# EAGLE schematic Hauptplatine (EAGLE 8.6.0)
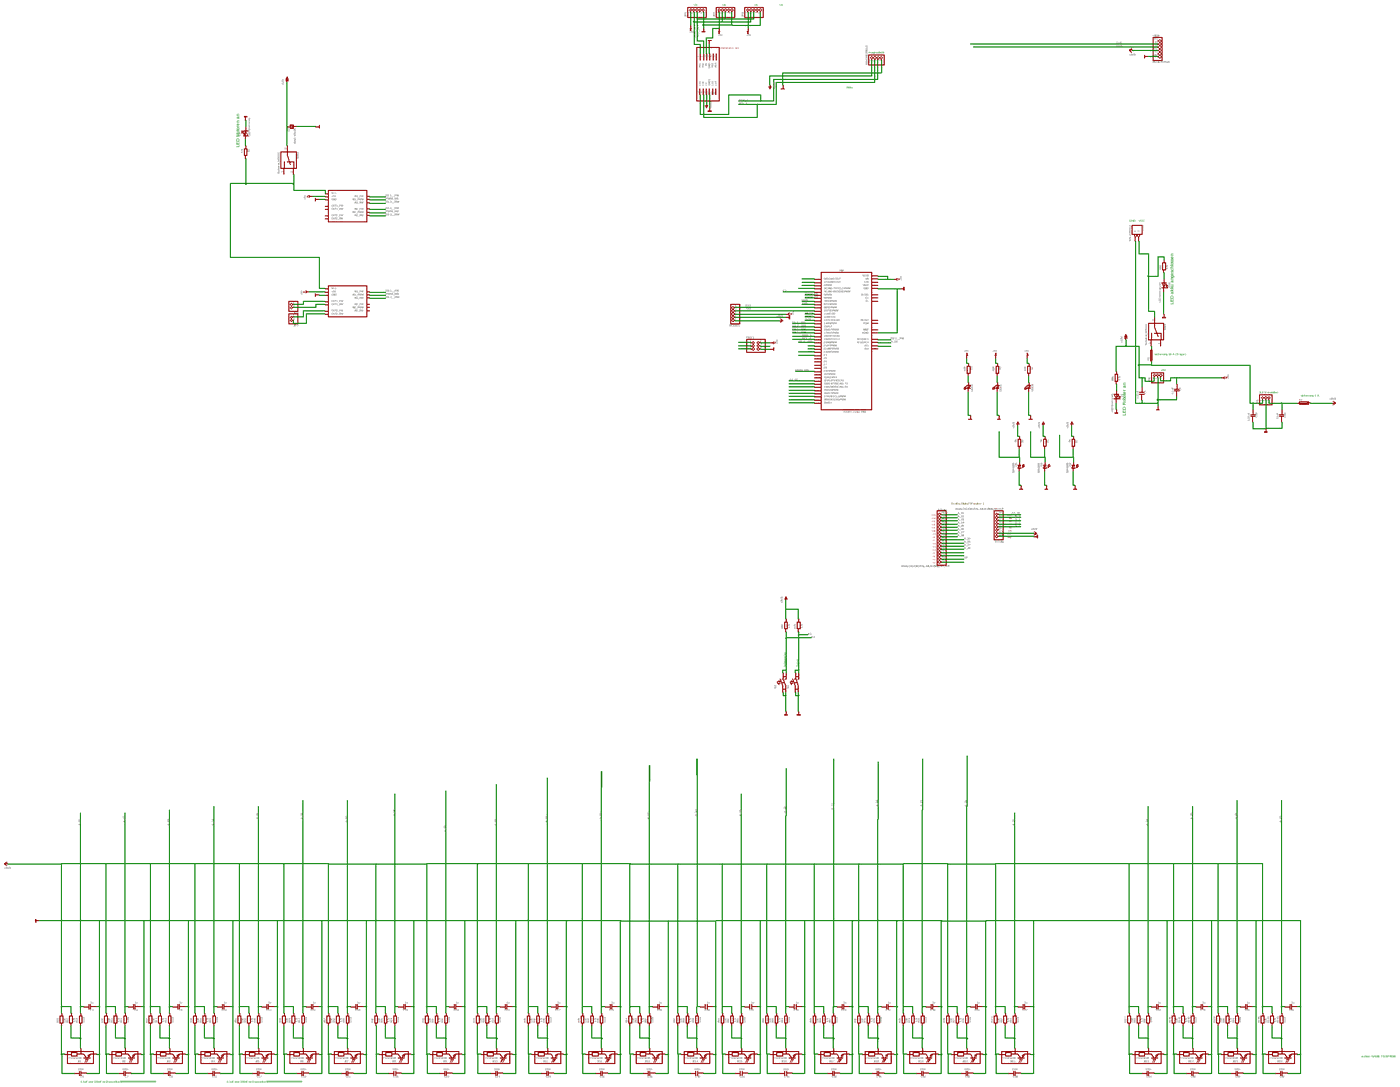
[diagram p0: schematic, sheet 1, overview]
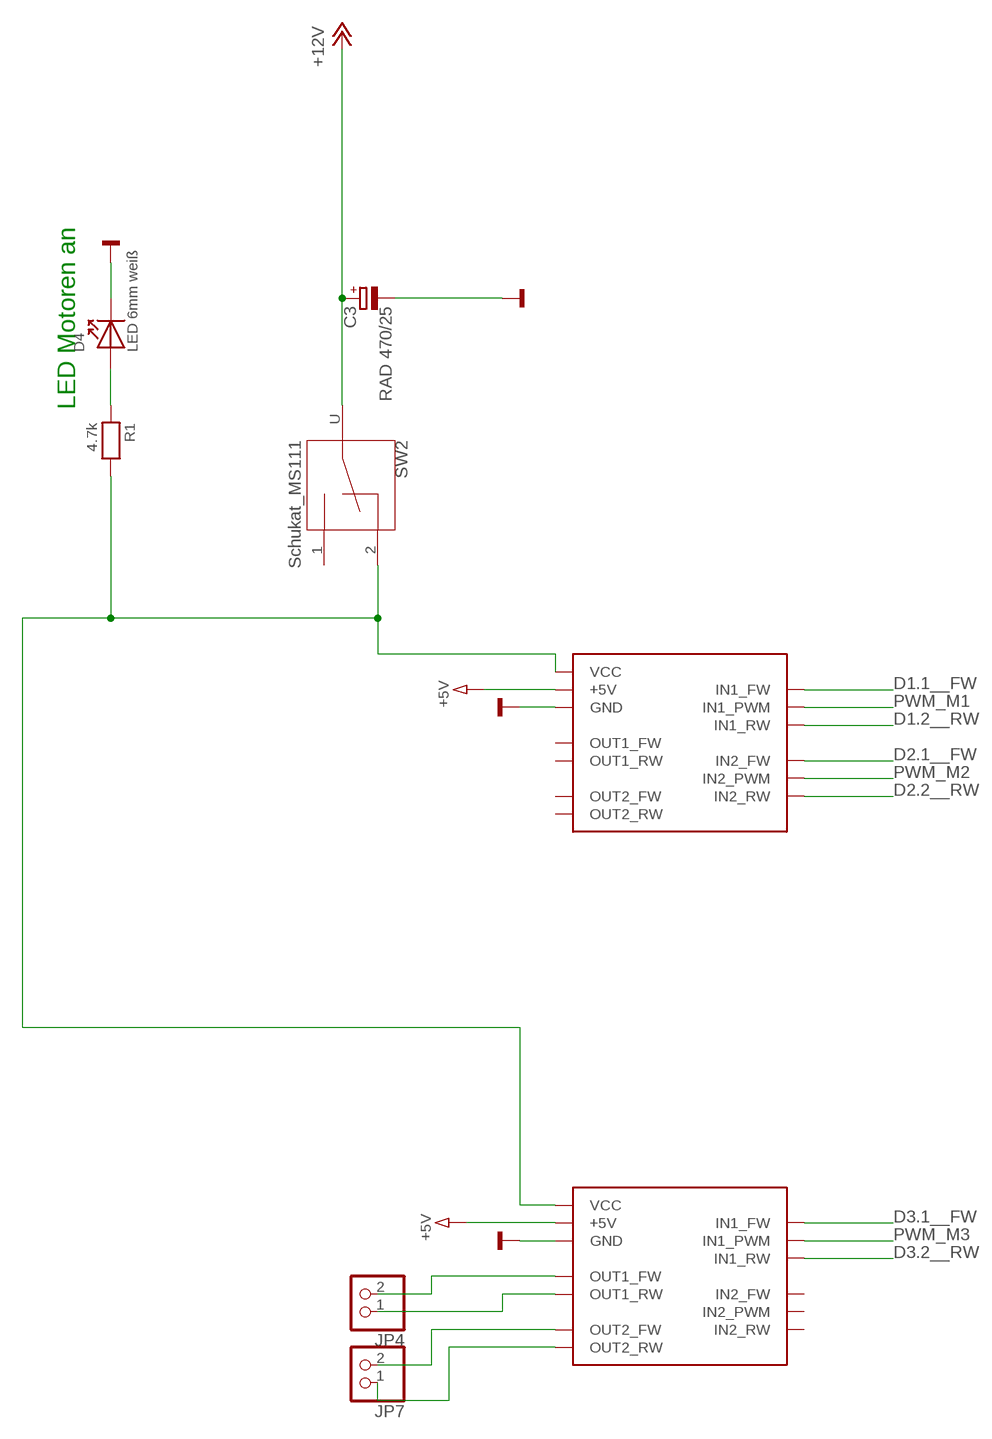
[diagram p1: schematic, sheet 1, part 1 of 6]
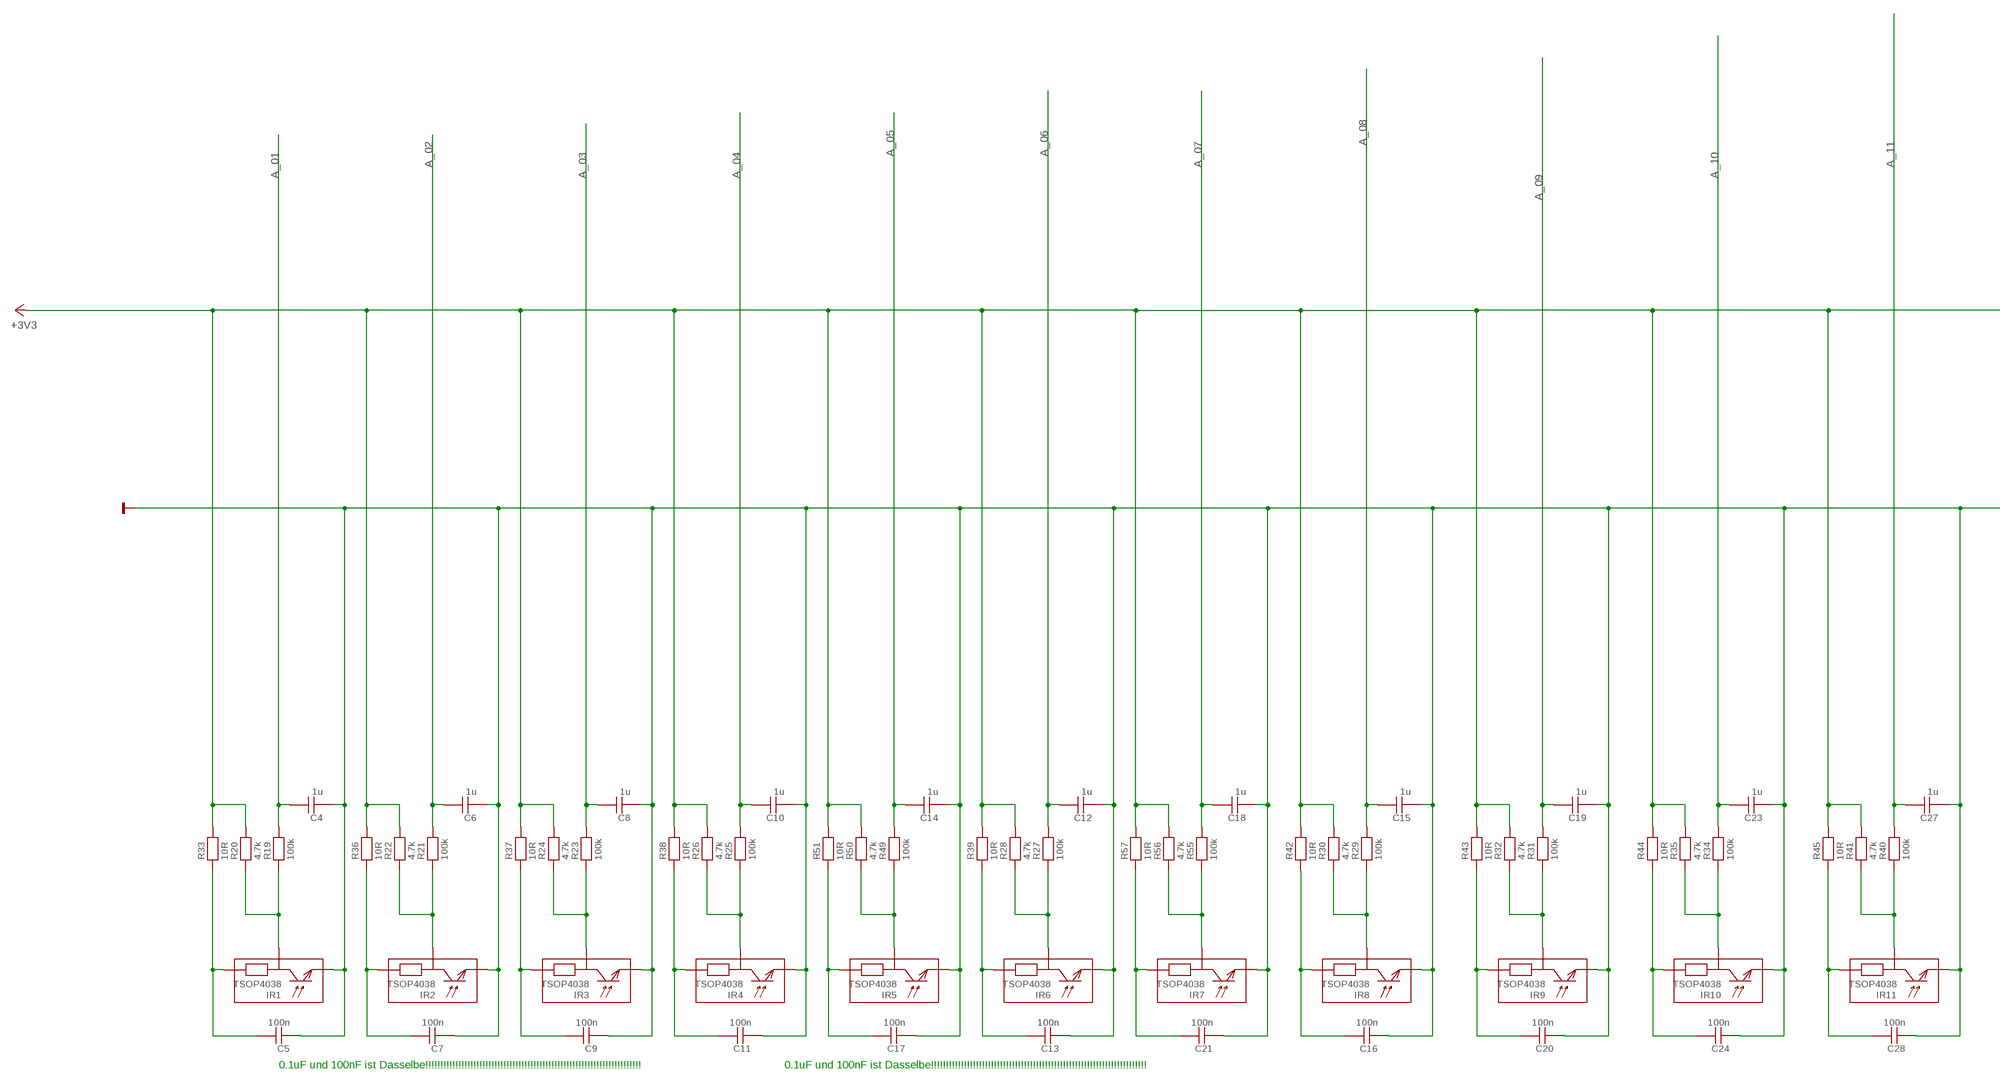
[diagram p2: schematic, sheet 1, part 2 of 6]
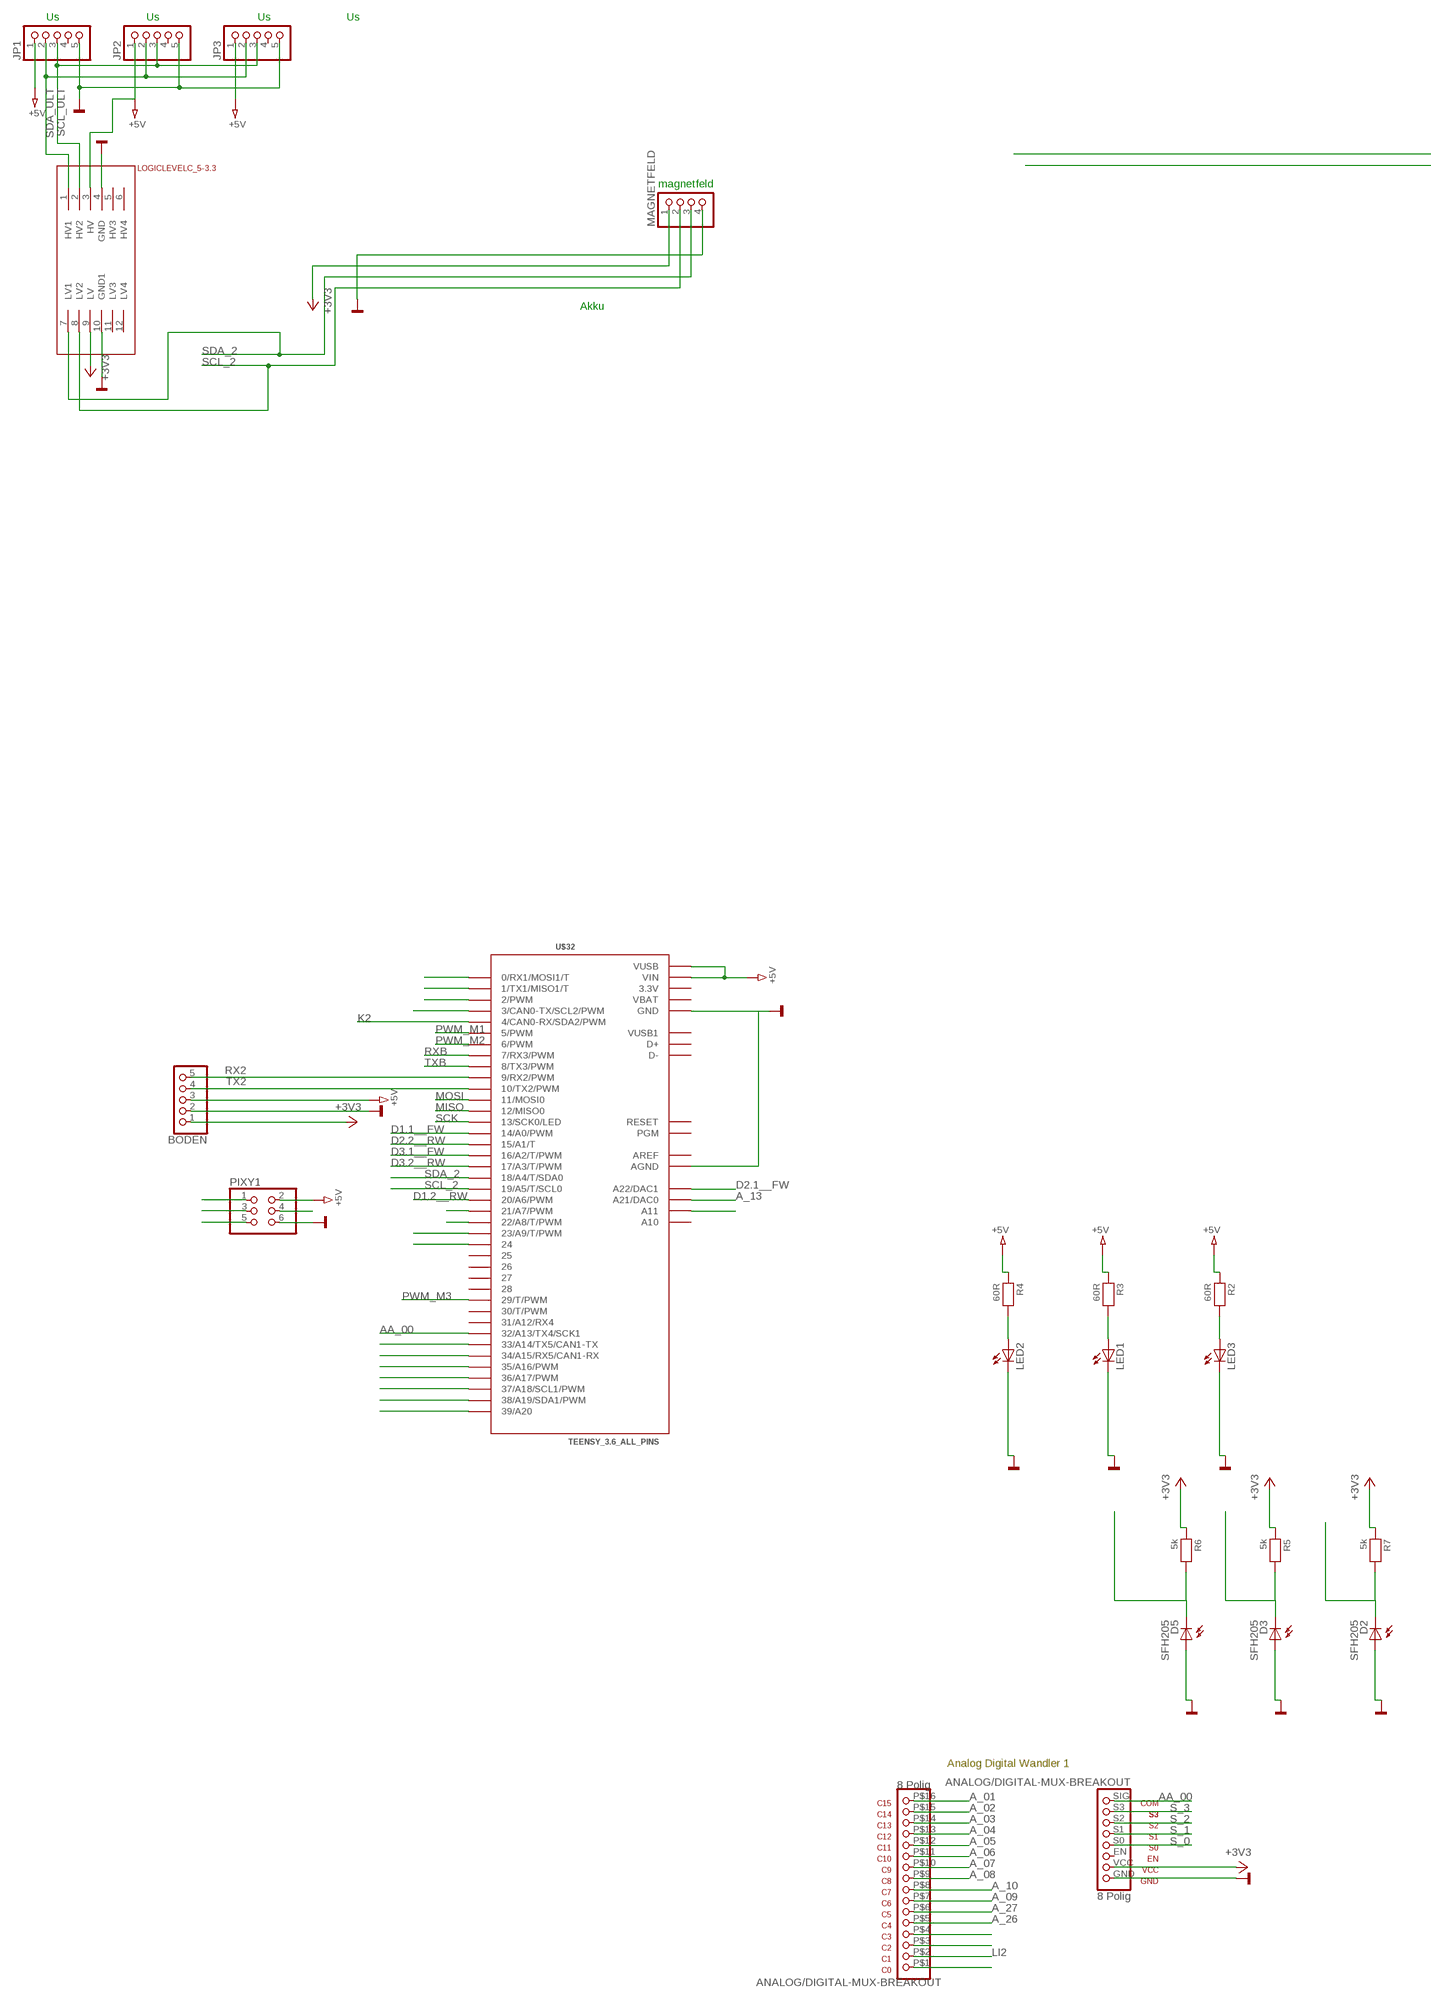
[diagram p3: schematic, sheet 1, part 3 of 6]
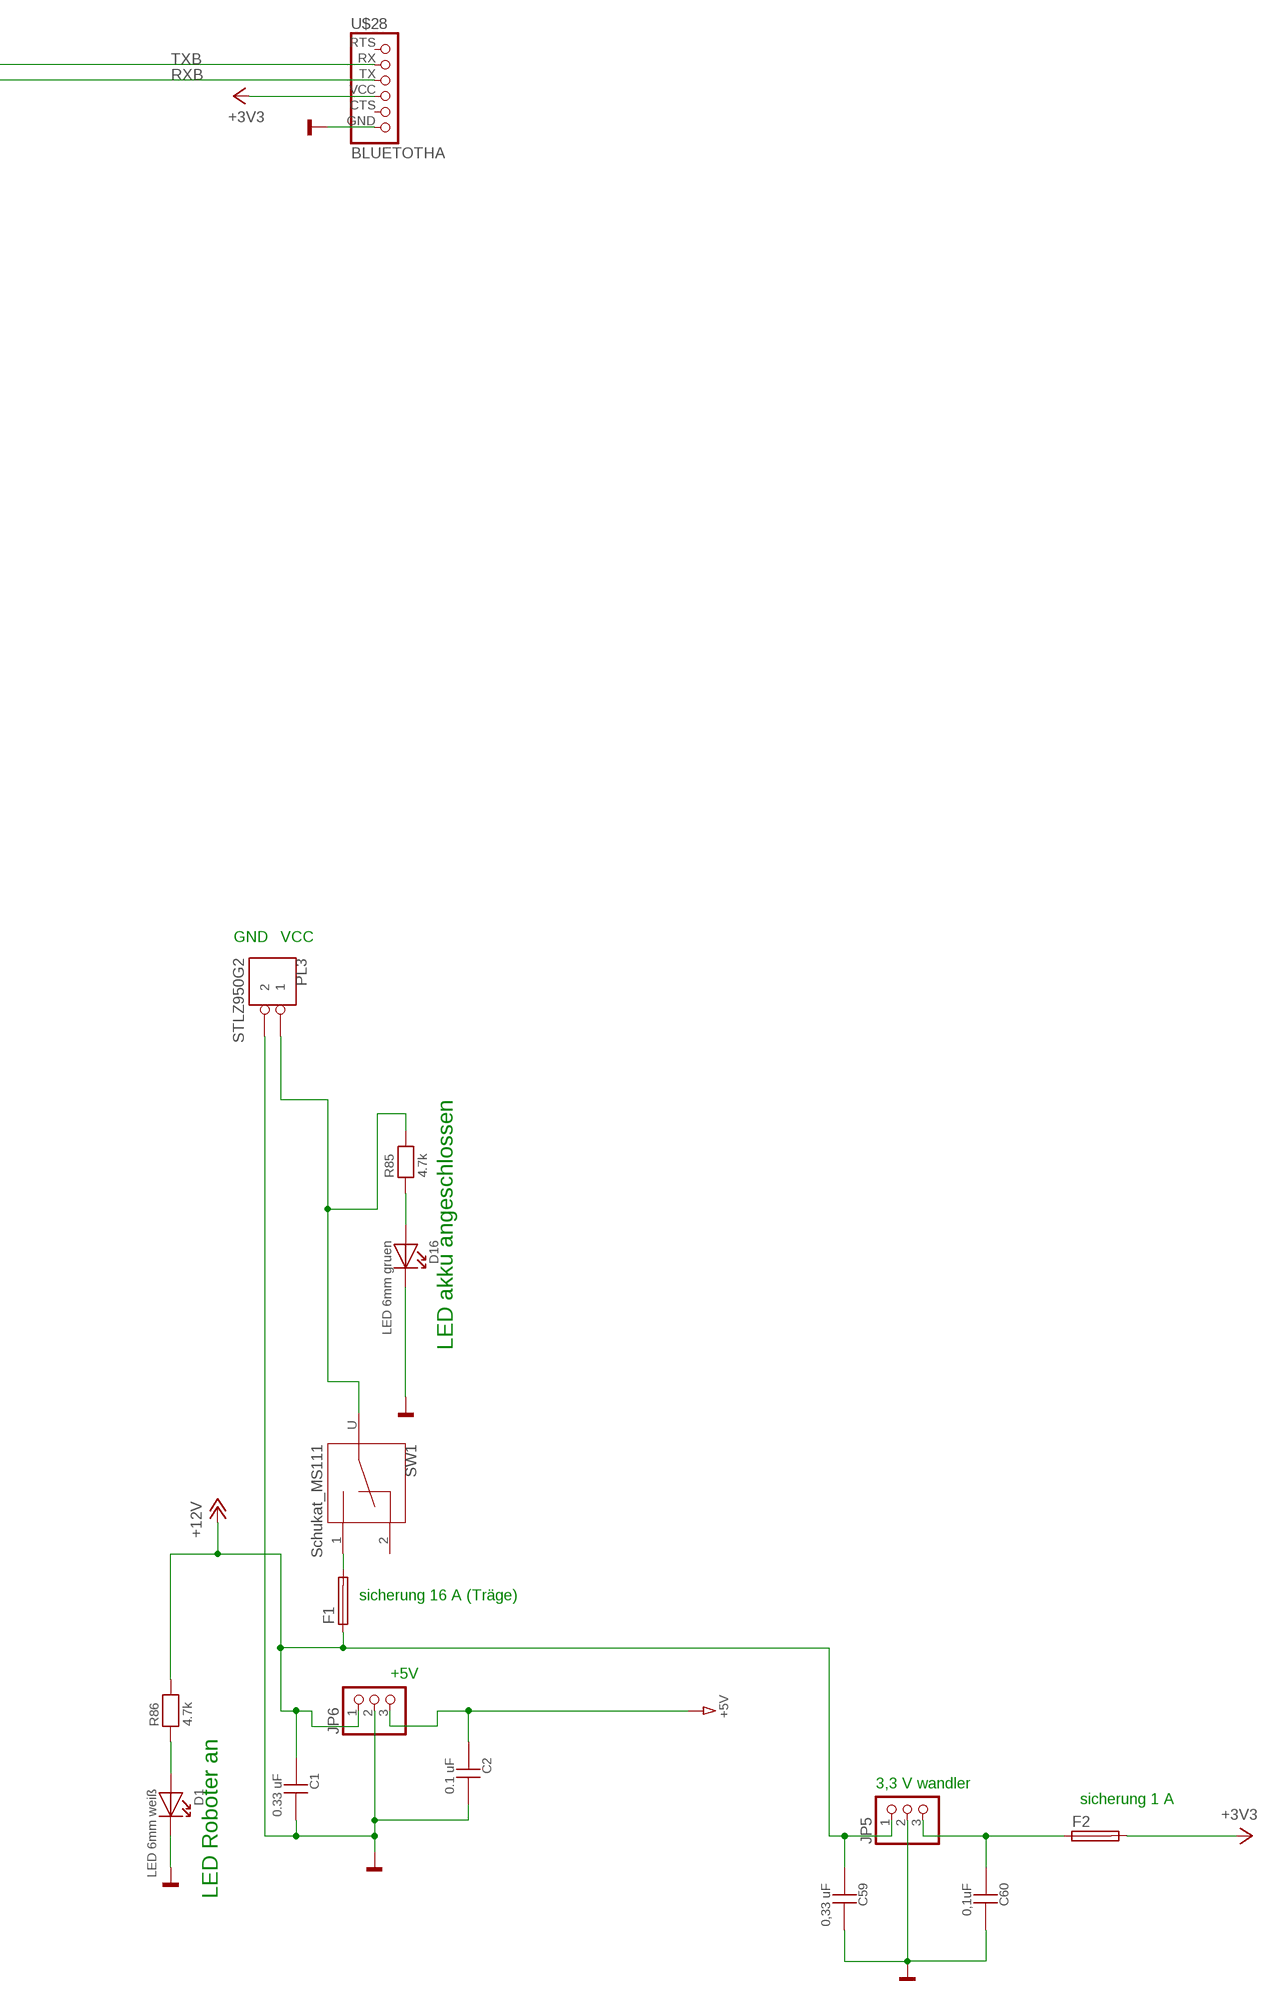
[diagram p4: schematic, sheet 1, part 4 of 6]
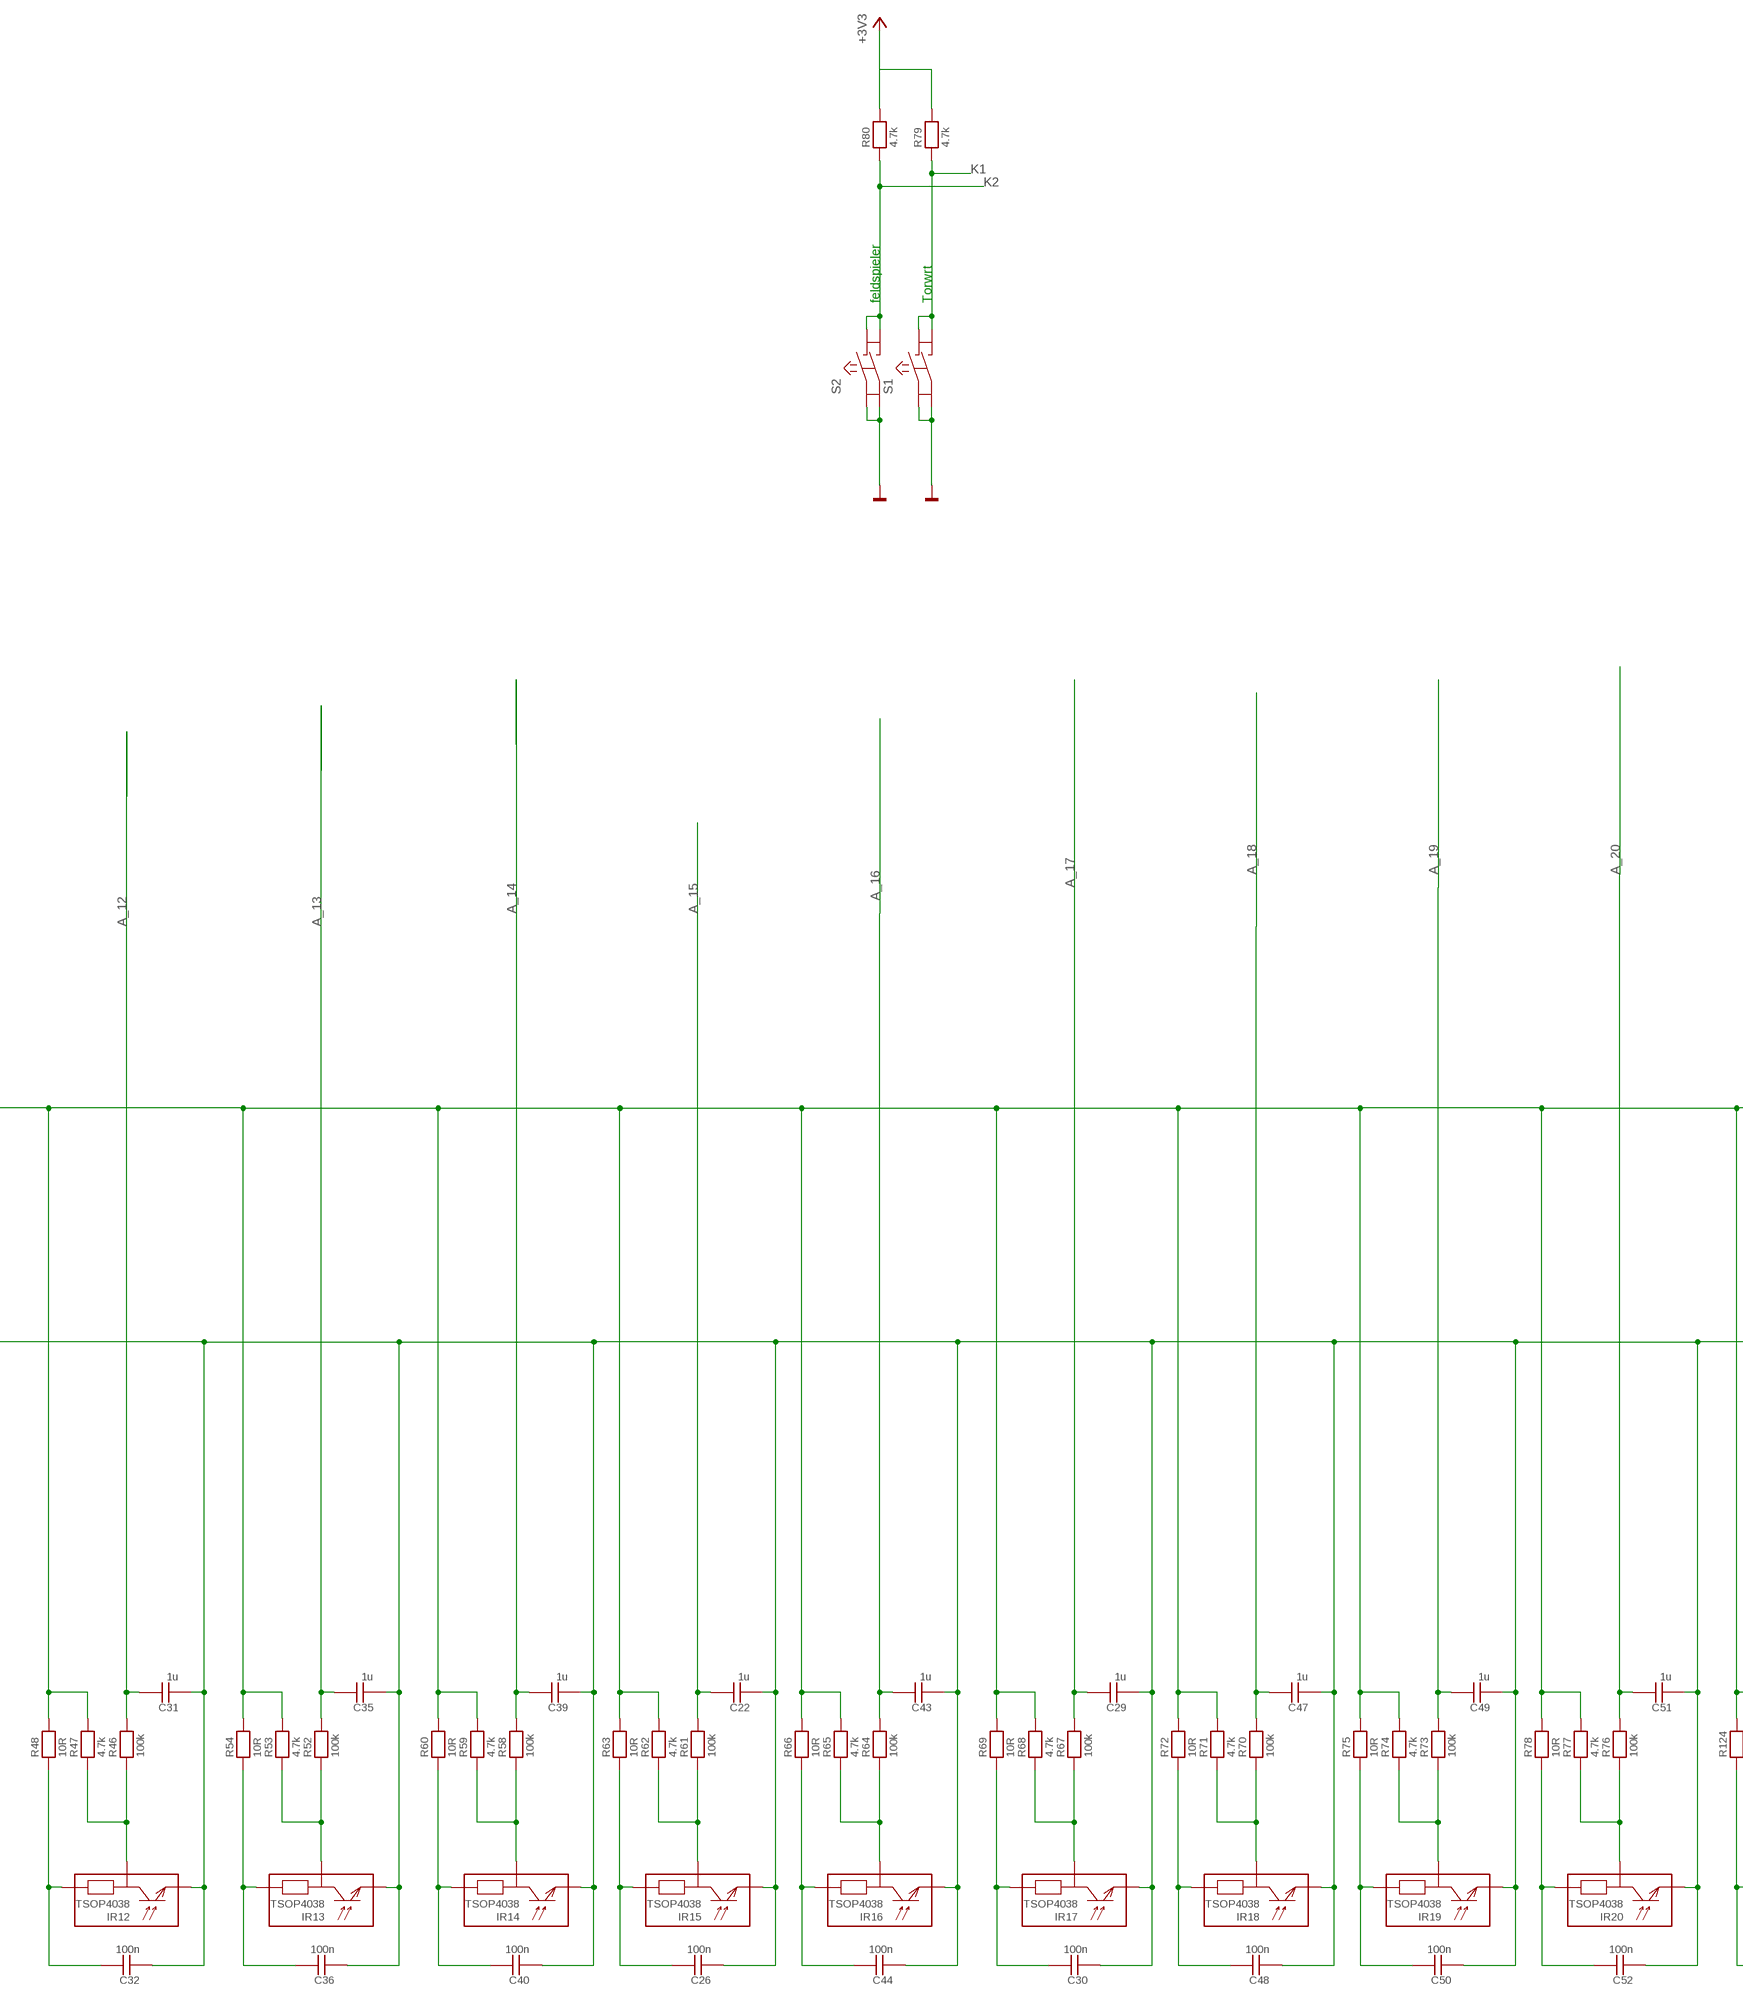
[diagram p5: schematic, sheet 1, part 5 of 6]
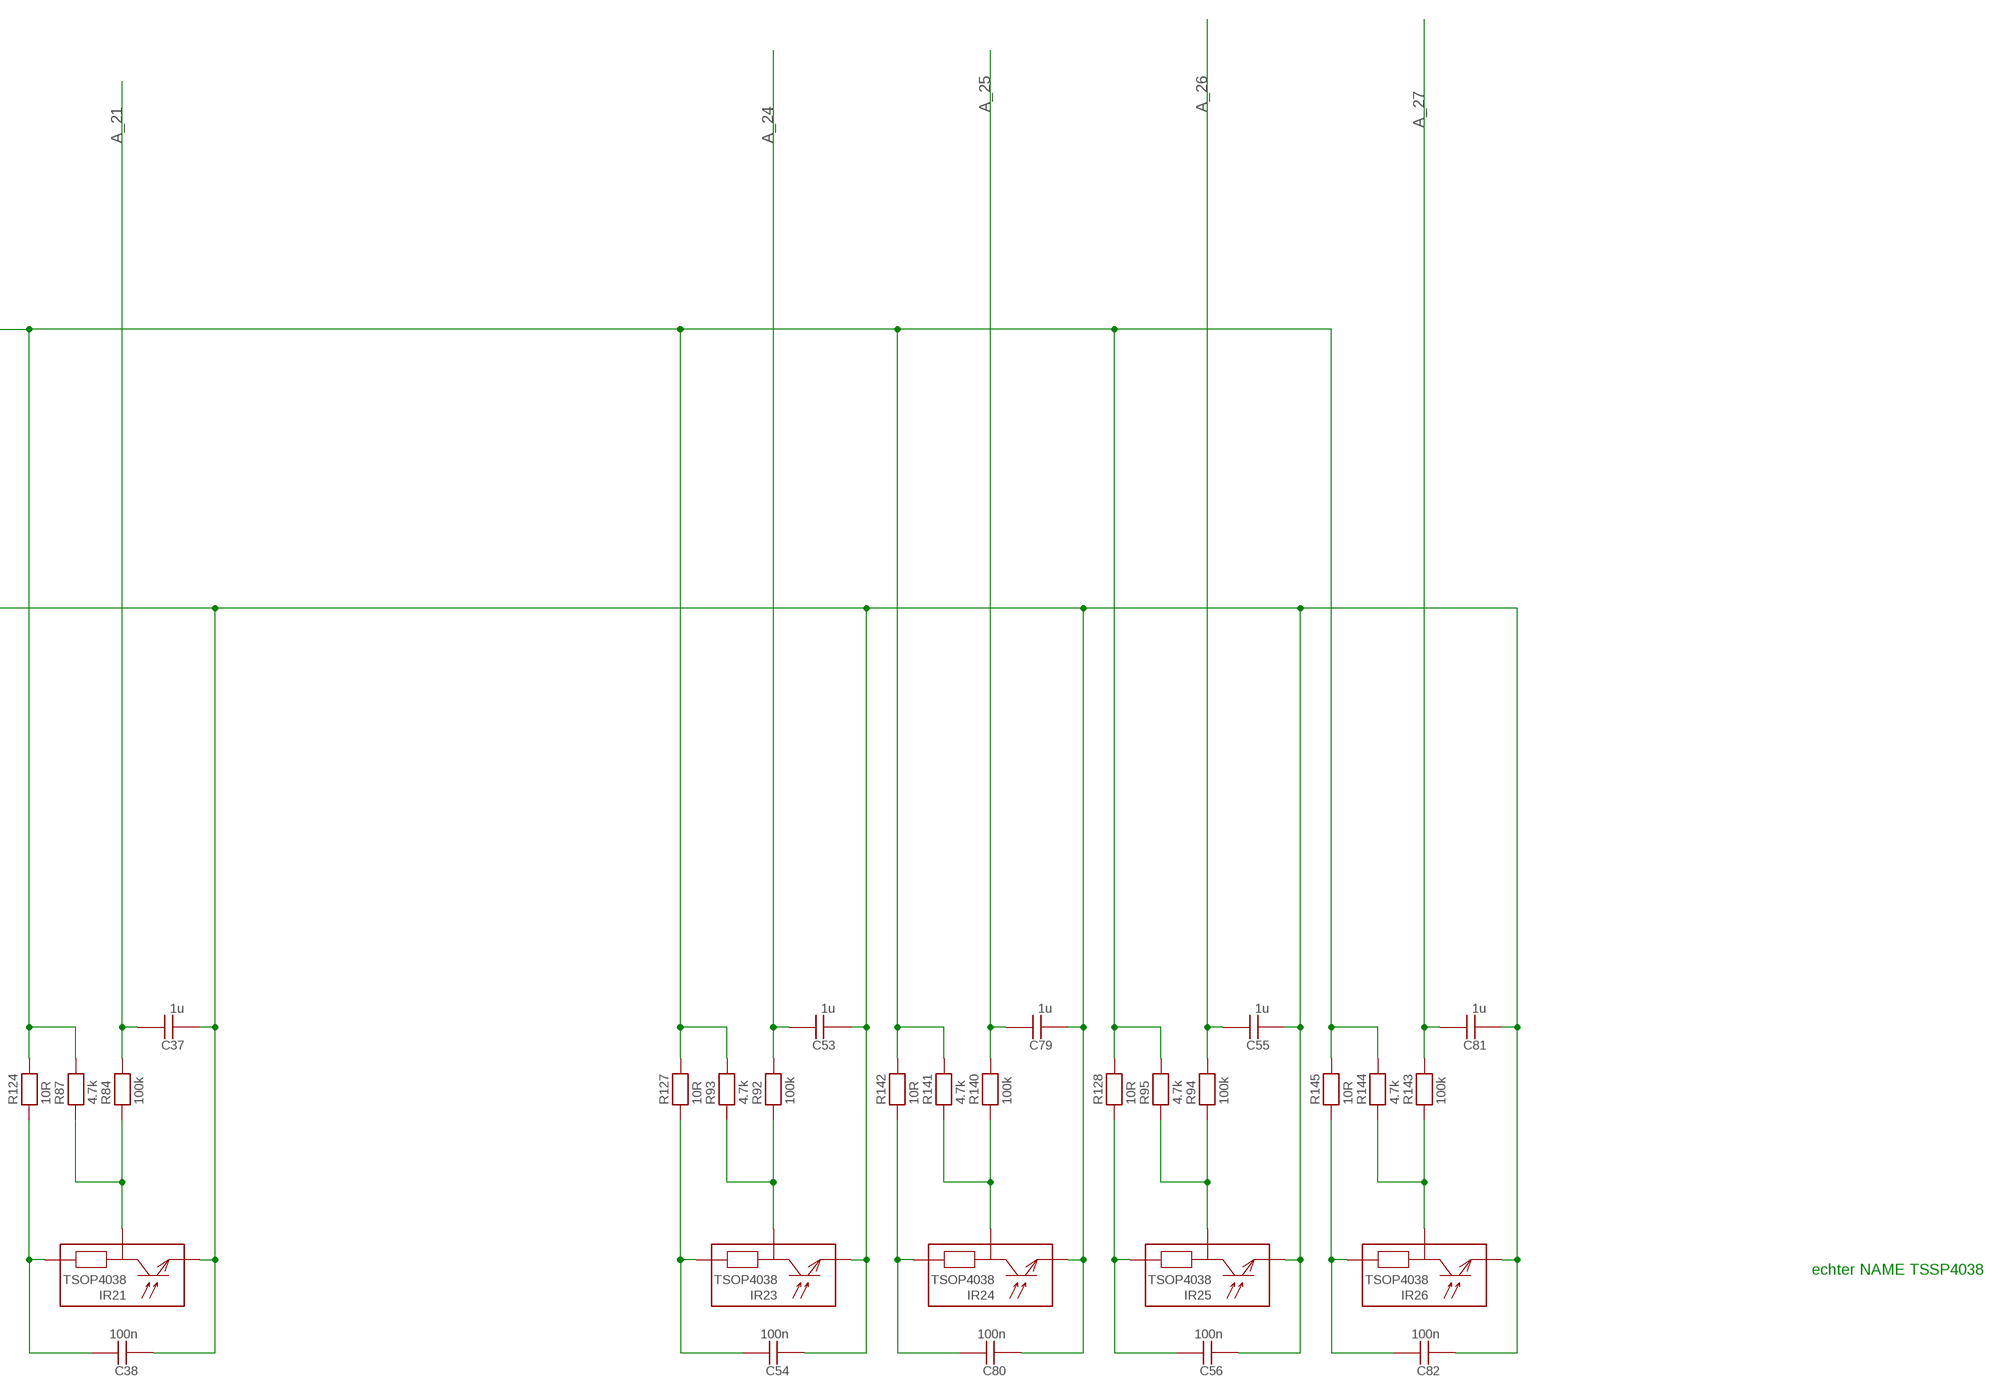
[diagram p6: schematic, sheet 1, part 6 of 6]

## Parts
BODEN  PINHD-1X5  [1X05]
C1  0.33 uF  C1206  [1206]
C2  0.1 uF  C1206  [1206]
C3  RAD 470/25  CPOL-EUE5-10.5  [E5-10,5]
C4  1u  C1206  [1206]
C5  100n  C1206  [1206]
C6  1u  C1206  [1206]
C7  100n  C1206  [1206]
C8  1u  C1206  [1206]
C9  100n  C1206  [1206]
C10  1u  C1206  [1206]
C11  100n  C1206  [1206]
C12  1u  C1206  [1206]
C13  100n  C1206  [1206]
C14  1u  C1206  [1206]
C15  1u  C1206  [1206]
C16  100n  C1206  [1206]
C17  100n  C1206  [1206]
C18  1u  C1206  [1206]
C19  1u  C1206  [1206]
C20  100n  C1206  [1206]
C21  100n  C1206  [1206]
C22  1u  C1206  [1206]
C23  1u  C1206  [1206]
C24  100n  C1206  [1206]
C26  100n  C1206  [1206]
C27  1u  C1206  [1206]
C28  100n  C1206  [1206]
C29  1u  C1206  [1206]
C30  100n  C1206  [1206]
C31  1u  C1206  [1206]
C32  100n  C1206  [1206]
C35  1u  C1206  [1206]
C36  100n  C1206  [1206]
C37  1u  C1206  [1206]
C38  100n  C1206  [1206]
C39  1u  C1206  [1206]
C40  100n  C1206  [1206]
C43  1u  C1206  [1206]
C44  100n  C1206  [1206]
C47  1u  C1206  [1206]
C48  100n  C1206  [1206]
C49  1u  C1206  [1206]
C50  100n  C1206  [1206]
C51  1u  C1206  [1206]
C52  100n  C1206  [1206]
C53  1u  C1206  [1206]
C54  100n  C1206  [1206]
C55  1u  C1206  [1206]
C56  100n  C1206  [1206]
C59  0,33 uF  C1206  [1206]
C60  0,1uF  C1206  [1206]
C79  1u  C1206  [1206]
C80  100n  C1206  [1206]
C81  1u  C1206  [1206]
C82  100n  C1206  [1206]
D1  LED 6mm weiß  L3R2-08  [L3R2-08]
D2  SFH205  [SFH205]
D3  SFH205  [SFH205]
D4  LED 6mm weiß  L3R2-08  [L3R2-08]
D5  SFH205  [SFH205]
D16  LED 6mm gruen  L3R2-08  [L3R2-08]
F1  SH22,5  [SH22,5]
F2  SH22,5  [SH22,5]
IR1  TSOP4038  [TSOP581X]
IR2  TSOP4038  [TSOP581X]
IR3  TSOP4038  [TSOP581X]
IR4  TSOP4038  [TSOP581X]
IR5  TSOP4038  [TSOP581X]
IR6  TSOP4038  [TSOP581X]
IR7  TSOP4038  [TSOP581X]
IR8  TSOP4038  [TSOP581X]
IR9  TSOP4038  [TSOP581X]
IR10  TSOP4038  [TSOP581X]
IR11  TSOP4038  [TSOP581X]
IR12  TSOP4038  [TSOP581X]
IR13  TSOP4038  [TSOP581X]
IR14  TSOP4038  [TSOP581X]
IR15  TSOP4038  [TSOP581X]
IR16  TSOP4038  [TSOP581X]
IR17  TSOP4038  [TSOP581X]
IR18  TSOP4038  [TSOP581X]
IR19  TSOP4038  [TSOP581X]
IR20  TSOP4038  [TSOP581X]
IR21  TSOP4038  [TSOP581X]
IR23  TSOP4038  [TSOP581X]
IR24  TSOP4038  [TSOP581X]
IR25  TSOP4038  [TSOP581X]
IR26  TSOP4038  [TSOP581X]
JP1  PINHD-1X5  [1X05]
JP2  PINHD-1X5  [1X05]
JP3  PINHD-1X5  [1X05]
JP4  PINHD-1X2  [1X02]
JP5  PINHD-1X3  [1X03]
JP6  PINHD-1X3  [1X03]
JP7  PINHD-1X2  [1X02]
LED1  LED3MM  [LED3MM]
LED2  LED3MM  [LED3MM]
LED3  LED3MM  [LED3MM]
MAGNETFELD  PINHD-1X4  [1X04]
PIXY1  PINHD-2X3  [2X03]
PL3  STLZ950G2  [S940_2]
R1  4.7k  R1206  [1206]
R2  60R  R1206  [1206]
R3  60R  R1206  [1206]
R4  60R  R1206  [1206]
R5  5k  R1206  [1206]
R6  5k  R1206  [1206]
R7  5k  R1206  [1206]
R19  100k  R1206  [1206]
R20  4.7k  R1206  [1206]
R21  100k  R1206  [1206]
R22  4.7k  R1206  [1206]
R23  100k  R1206  [1206]
R24  4.7k  R1206  [1206]
R25  100k  R1206  [1206]
R26  4.7k  R1206  [1206]
R27  100k  R1206  [1206]
R28  4.7k  R1206  [1206]
R29  100k  R1206  [1206]
R30  4.7k  R1206  [1206]
R31  100k  R1206  [1206]
R32  4.7k  R1206  [1206]
R33  10R  R1206  [1206]
R34  100k  R1206  [1206]
R35  4.7k  R1206  [1206]
R36  10R  R1206  [1206]
R37  10R  R1206  [1206]
R38  10R  R1206  [1206]
R39  10R  R1206  [1206]
R40  100k  R1206  [1206]
R41  4.7k  R1206  [1206]
R42  10R  R1206  [1206]
R43  10R  R1206  [1206]
R44  10R  R1206  [1206]
R45  10R  R1206  [1206]
R46  100k  R1206  [1206]
R47  4.7k  R1206  [1206]
R48  10R  R1206  [1206]
R49  100k  R1206  [1206]
R50  4.7k  R1206  [1206]
R51  10R  R1206  [1206]
R52  100k  R1206  [1206]
R53  4.7k  R1206  [1206]
R54  10R  R1206  [1206]
R55  100k  R1206  [1206]
R56  4.7k  R1206  [1206]
R57  10R  R1206  [1206]
R58  100k  R1206  [1206]
R59  4.7k  R1206  [1206]
R60  10R  R1206  [1206]
R61  100k  R1206  [1206]
R62  4.7k  R1206  [1206]
R63  10R  R1206  [1206]
R64  100k  R1206  [1206]
R65  4.7k  R1206  [1206]
R66  10R  R1206  [1206]
R67  100k  R1206  [1206]
R68  4.7k  R1206  [1206]
R69  10R  R1206  [1206]
R70  100k  R1206  [1206]
R71  4.7k  R1206  [1206]
R72  10R  R1206  [1206]
R73  100k  R1206  [1206]
R74  4.7k  R1206  [1206]
R75  10R  R1206  [1206]
R76  100k  R1206  [1206]
R77  4.7k  R1206  [1206]
R78  10R  R1206  [1206]
R79  4.7k  R1206  [1206]
R80  4.7k  R1206  [1206]
R84  100k  R1206  [1206]
R85  4.7k  R1206  [1206]
R86  4.7k  R1206  [1206]
R87  4.7k  R1206  [1206]
R92  100k  R1206  [1206]
R93  4.7k  R1206  [1206]
R94  100k  R1206  [1206]
R95  4.7k  R1206  [1206]
R124  10R  R1206  [1206]
R127  10R  R1206  [1206]
R128  10R  R1206  [1206]
R140  100k  R1206  [1206]
R141  4.7k  R1206  [1206]
R142  10R  R1206  [1206]
R143  100k  R1206  [1206]
R144  4.7k  R1206  [1206]
R145  10R  R1206  [1206]
S1  KSM611A  [KSM611A]
S2  KSM611A  [KSM611A]
SW1  Schukat_MS111  MSS13ASP  [MSS13ASP]
SW2  Schukat_MS111  MSS13ASP  [MSS13ASP]
U$1  MOTOR_DRIVER_MODULE  [MOTOR_DRIVER_MODULE]
U$6  MOTOR_DRIVER_MODULE  [MOTOR_DRIVER_MODULE]
U$28  BLUETOTHA  [BLUETOTHA]
U$32  TEENSY_3.6_ALL_PINS  [TEENSY_3.6_ALL_PINS]
U$58  LOGICLEVEL  [LOGICLEVEL]
X1  ANALOG/DIGITAL-MUX-BREAKOUT  [ANALOG/DIGITAL-MUX-BREAKOUT]

## Nets
+3V3: BODEN.1 F2.2 MAGNETFELD.1 R5.1 R6.1 R7.1 R20.2 R22.2 R24.2 R26.2 R28.2 R30.2 R32.2 R33.2 R35.2 R36.2 R37.2 R38.2 R39.2 R41.2 R42.2 R43.2 R44.2 R45.2 R47.2 R48.2 R50.2 R51.2 R53.2 R54.2 R56.2 R57.2 R59.2 R60.2 R62.2 R63.2 R65.2 R66.2 R68.2 R69.2 R71.2 R72.2 R74.2 R75.2 R77.2 R78.2 R79.2 R80.2 R87.2 R93.2 R95.2 R124.2 R127.2 R128.2 R141.2 R142.2 R144.2 R145.2 U$28.VCC U$58.9(LV) X1.VCC
+5V: BODEN.3 C2.2 JP1.1 JP2.1 JP3.1 JP6.3 PIXY1.2 R2.1 R3.1 R4.1 U$1.+5V U$6.+5V U$32.VIN U$32.VUSB U$58.3(HV)
+12V: C1.2 C3.+ C59.2 F1.1 JP5.1 JP6.1 R86.2 SW2.U(U1)
+12V1: R1.2 SW2.2(R1) U$1.VCC@1(VCC) U$1.VCC@2(VCC) U$1.VCC@3(VCC) U$6.VCC@1(VCC) U$6.VCC@2(VCC) U$6.VCC@3(VCC)
A_01: C4.1 R19.2 X1.P$16
A_02: C6.1 R21.2 X1.P$15
A_03: C8.1 R23.2 X1.P$14
A_04: C10.1 R25.2 X1.P$13
A_05: C14.1 R49.2 X1.P$12
A_06: C12.1 R27.2 X1.P$11
A_07: C18.1 R55.2 X1.P$10
A_08: C15.1 R29.2 X1.P$9
A_09: C19.1 R31.2 X1.P$7
A_10: C23.1 R34.2 X1.P$8
A_11: C27.1 R40.2 U$32.23/A9(23/A9/T/PWM)
A_12: C31.1 R46.2 U$32.39/A20
A_13: C35.1 R52.2 U$32.A21(A21/DAC0)
A_14: C39.1 R58.2 U$32.21/A7(21/A7/PWM)
A_15: C22.1 R61.2 U$32.22/A8(22/A8/T/PWM)
A_16: C43.1 R64.2 U$32.34/A15(34/A15/RX5/CAN1-RX)
A_17: C29.1 R67.2 U$32.35/A16(35/A16/PWM)
A_18: C47.1 R70.2 U$32.36/A17(36/A17/PWM)
A_19: C49.1 R73.2 U$32.37/A18(37/A18/SCL1/PWM)
A_20: C51.1 R76.2 U$32.38/A19(38/A19/SDA1/PWM)
A_21: C37.1 R84.2 U$32.33/A14(33/A14/TX5/CAN1-TX)
A_24: C53.1 R92.2 X1.P$4
A_25: C79.1 R140.2 U$32.A11
A_26: C55.1 R94.2 X1.P$5
A_27: C81.1 R143.2 X1.P$6
AA_00: U$32.32/A13(32/A13/TX4/SCK1) X1.SIG(COM)
D1.1__FW: U$1.M1_FW_SIG(IN1_FW) U$32.14/A0(14/A0/PWM)
D1.2__RW: U$1.M1_RW_SIG(IN1_RW) U$32.20/A6(20/A6/PWM)
D2.1__FW: U$1.M2_FW_SIG(IN2_FW) U$32.A22(A22/DAC1)
D2.2__RW: U$1.M2_RW_SIG(IN2_RW) U$32.15/A1(15/A1/T)
D3.1__FW: U$6.M1_FW_SIG(IN1_FW) U$32.16/A2(16/A2/T/PWM)
D3.2__RW: U$6.M1_RW_SIG(IN1_RW) U$32.17/A3(17/A3/T/PWM)
GND: BODEN.2 C1.1 C2.1 C3.- C4.2 C5.2 C6.2 C7.2 C8.2 C9.2 C10.2 C11.2 C12.2 C13.2 C14.2 C15.2 C16.2 C17.2 C18.2 C19.2 C20.2 C21.2 C22.2 C23.2 C24.2 C26.2 C27.2 C28.2 C29.2 C30.2 C31.2 C32.2 C35.2 C36.2 C37.2 C38.2 C39.2 C40.2 C43.2 C44.2 C47.2 C48.2 C49.2 C50.2 C51.2 C52.2 C53.2 C54.2 C55.2 C56.2 C59.1 C60.1 C79.2 C80.2 C81.2 C82.2 D1.2(K) D2.A D3.A D4.2(K) D5.A D16.2(K) IR1.2(GND) IR2.2(GND) IR3.2(GND) IR4.2(GND) IR5.2(GND) IR6.2(GND) IR7.2(GND) IR8.2(GND) IR9.2(GND) IR10.2(GND) IR11.2(GND) IR12.2(GND) IR13.2(GND) IR14.2(GND) IR15.2(GND) IR16.2(GND) IR17.2(GND) IR18.2(GND) IR19.2(GND) IR20.2(GND) IR21.2(GND) IR23.2(GND) IR24.2(GND) IR25.2(GND) IR26.2(GND) JP1.5 JP2.5 JP3.5 JP5.2 JP6.2 LED1.K(C) LED2.K(C) LED3.K(C) MAGNETFELD.4 PIXY1.6 PL3.2 S1.A S1.C S2.A S2.C U$1.GND@1(GND) U$1.GND@2(GND) U$1.GND@3(GND) U$1.GND@4(GND) U$6.GND@1(GND) U$6.GND@2(GND) U$6.GND@3(GND) U$6.GND@4(GND) U$28.GND U$32.AGND U$32.GND U$32.GND1(GND) U$32.GND3(GND) U$32.GND4(GND) U$32.GND6(GND) U$58.4(GND) U$58.10(GND1) X1.GND
K1: R79.1 S1.B S1.D U$32.24
K2: R80.1 S2.B S2.D U$32.4(4/CAN0-RX/SDA2/PWM)
LI1: D5.K(C) R6.2 X1.P$1
LI2: D3.K(C) R5.2 X1.P$2
LI3: D2.K(C) R7.2 X1.P$3
MISO: PIXY1.1 U$32.12(12/MISO0)
MOSI: PIXY1.4 U$32.11(11/MOSI0)
N$1: JP4.2 U$6.M1_FW(OUT1_FW)
N$2: F1.2 SW1.1(A1)
N$3: JP4.1 U$6.M1_RW(OUT1_RW)
N$4: C60.2 F2.1 JP5.3
N$5: JP7.2 U$6.M2_FW(OUT2_FW)
N$6: JP7.1 U$6.M2_RW(OUT2_RW)
N$7: LED3.A R2.2
N$8: LED1.A R3.2
N$10: LED2.A R4.2
N$12: D4.1(A) R1.1
N$13: PIXY1.5
N$20: PL3.1 R85.2 SW1.U(U1)
N$21: IR1.1(VO) R19.1 R20.1
N$24: C5.1 IR1.3(VS) R33.1
N$25: IR2.1(VO) R21.1 R22.1
N$26: C7.1 IR2.3(VS) R36.1
N$27: IR3.1(VO) R23.1 R24.1
N$28: C9.1 IR3.3(VS) R37.1
N$29: IR4.1(VO) R25.1 R26.1
N$30: C11.1 IR4.3(VS) R38.1
N$31: IR6.1(VO) R27.1 R28.1
N$32: C13.1 IR6.3(VS) R39.1
N$33: IR8.1(VO) R29.1 R30.1
N$34: IR9.1(VO) R31.1 R32.1
N$35: C20.1 IR9.3(VS) R43.1
N$36: IR10.1(VO) R34.1 R35.1
N$37: C24.1 IR10.3(VS) R44.1
N$38: C16.1 IR8.3(VS) R42.1
N$39: IR5.1(VO) R49.1 R50.1
N$40: IR11.1(VO) R40.1 R41.1
N$41: C28.1 IR11.3(VS) R45.1
N$42: IR12.1(VO) R46.1 R47.1
N$43: C32.1 IR12.3(VS) R48.1
N$44: C17.1 IR5.3(VS) R51.1
N$45: IR7.1(VO) R55.1 R56.1
N$46: C21.1 IR7.3(VS) R57.1
N$47: IR15.1(VO) R61.1 R62.1
N$48: C26.1 IR15.3(VS) R63.1
N$49: IR17.1(VO) R67.1 R68.1
N$50: C30.1 IR17.3(VS) R69.1
N$51: IR21.1(VO) R84.1 R87.1
N$52: C38.1 IR21.3(VS) R124.1
N$53: IR13.1(VO) R52.1 R53.1
N$54: C36.1 IR13.3(VS) R54.1
N$59: IR14.1(VO) R58.1 R59.1
N$60: C40.1 IR14.3(VS) R60.1
N$61: IR23.1(VO) R92.1 R93.1
N$62: C54.1 IR23.3(VS) R127.1
N$63: IR25.1(VO) R94.1 R95.1
N$64: C56.1 IR25.3(VS) R128.1
N$66: IR16.1(VO) R64.1 R65.1
N$67: C44.1 IR16.3(VS) R66.1
N$72: IR18.1(VO) R70.1 R71.1
N$73: C48.1 IR18.3(VS) R72.1
N$75: IR19.1(VO) R73.1 R74.1
N$76: C50.1 IR19.3(VS) R75.1
N$78: IR20.1(VO) R76.1 R77.1
N$79: C52.1 IR20.3(VS) R78.1
N$100: IR24.1(VO) R140.1 R141.1
N$101: C80.1 IR24.3(VS) R142.1
N$102: IR26.1(VO) R143.1 R144.1
N$103: C82.1 IR26.3(VS) R145.1
N$107: D16.1(A) R85.1
N$113: D1.1(A) R86.1
PWM_M1: U$1.M1_PWM_SIG(IN1_PWM) U$32.5(5/PWM)
PWM_M2: U$1.M2_PWM_SIG(IN2_PWM) U$32.6(6/PWM)
PWM_M3: U$6.M1_PWM_SIG(IN1_PWM) U$32.29(29/T/PWM)
RX2: BODEN.5 U$32.9(9/RX2/PWM)
RXB: U$28.TX U$32.7(7/RX3/PWM)
S_0: U$32.0(0/RX1/MOSI1/T) X1.S0
S_1: U$32.1(1/TX1/MISO1/T) X1.S1
S_2: U$32.2(2/PWM) X1.S2
S_3: U$32.3(3/CAN0-TX/SCL2/PWM) X1.S3
SCK: PIXY1.3 U$32.13(13/SCK0/LED)
SCL_2: MAGNETFELD.2 U$32.19/A5(19/A5/T/SCL0) U$58.8(LV2)
SCL_ULT: JP1.3 JP2.3 JP3.3 U$58.2(HV2)
SDA_2: MAGNETFELD.3 U$32.18/A4(18/A4/T/SDA0) U$58.7(LV1)
SDA_ULT: JP1.2 JP2.2 JP3.2 U$58.1(HV1)
TX2: BODEN.4 U$32.10(10/TX2/PWM)
TXB: U$28.RX U$32.8(8/TX3/PWM)
Unconnected: JP1.4 JP2.4 JP3.4 SW1.2(R1) SW2.1(A1) U$1.M1_FW(OUT1_FW) U$1.M1_RW(OUT1_RW) U$1.M2_FW(OUT2_FW) U$1.M2_RW(OUT2_RW) U$6.M2_FW_SIG(IN2_FW) U$6.M2_PWM_SIG(IN2_PWM) U$6.M2_RW_SIG(IN2_RW) U$28.CTS U$28.RTS(DTR) U$32.25 U$32.26 U$32.27 U$32.28 U$32.30(30/T/PWM) U$32.31/A12(31/A12/RX4) U$32.A10 U$32.D+ U$32.D- U$32.PGM U$32.RESET U$58.5(HV3) U$58.6(HV4) U$58.11(LV3) U$58.12(LV4) X1.EN

## Notes on the sheet
- Us | Us | Us | Us
- magnetfeld
- Akku
- LED Motoren an
- GND | VCC
- LED akku angeschlossen
- sicherung 16 A (Träge)
- +5V
- 3,3 V wandler
- sicherung 1 A
- LED Roboter an
- Analog Digital Wandler 1
- feldspieler | Torwrt
- echter NAME TSSP4038
- 0.1uF und 100nF ist Dasselbe!!!!!!!!!!!!!!!!!!!!!!!!!!!!!!!!!!!!!!!!!!!!!!!!!!!!!!!!!!!!!!!!!!!!!!!! | 0.1uF und 100nF ist Dasselbe!!!!!!!!!!!!!!!!!!!!!!!!!!!!!!!!!!!!!!!!!!!!!!!!!!!!!!!!!!!!!!!!!!!!!!!!

## Power pins joined to a net without a drawn wire
3.3V: U$32.3.3V U$32.3.3V3(3.3V) U$32.3.3V4(3.3V)
AREF: U$32.AREF
VBAT: U$32.VBAT
VUSB1: U$32.VUSB1

## Library data of the parts
BODEN JP1-JP3 = pinhead:PINHD-1X5: PIN HEADER
C1 C2 C4-C24 C26-C32 C35-C40 C43 C44 C47-C56 C59 C60 C79-C82 = C:C1206
C3 = rcl:CPOL-EU: POLARIZED CAPACITOR, European symbol
D1 D4 D16 = d:L3R2-08
D2 D3 D5 = opto-trans-siemens:SFH205: PHOTO DIODE; OC_FARNELL: unknown; OC_NEWARK: unknown
F1 F2 = fuse:SH22,5: FUSE HOLDER grid 22,5 mm, OGN0031 8201, Schurter (Buerklin); MF: SCHURTER; MPN: 0031.8201; OC_FARNELL: 1162740; OC_NEWARK: 96F8317
IR1-IR21 IR23-IR26 = robotikbauteile:TSOP4038
JP4 JP7 = pinhead:PINHD-1X2: PIN HEADER
JP5 JP6 = pinhead:PINHD-1X3: PIN HEADER
LED1-LED3 = led:LED: LED OSRAM: - CHIPLED LG R971, LG N971, LY N971, LG Q971, LY Q971, LO R971, LY R971 LH N974, LH R974 LS Q976, LO Q976, LY Q976 LO Q996 - Hyper CHIPLED LW Q18S LB Q993, LB Q99A, LB R99A - SideLED LS A670, LO A670, LY A670, LG A670, LP A670 LB A673, LV A673, LT A673, LW A673 LH A674 LY A675 LS A676, LA A676, LO A676, LY A676, LW A676 LS A679, LY A679, LG A679 - Hyper Micro SIDELED® LS Y876, LA Y876, LO Y876, LY Y876 LT Y87S - SmartLED LW L88C, LW L88S LB L89C, LB L89S, LG L890 LS L89K, LO L89K, LY L89K LS L896, LA L896, LO L896, LY L896 - TOPLED LS T670, LO T670, LY T670, LG T670, LP T670 LSG T670, LSP T670, LSY T670, LOP T670, LYG T670 LG T671, LOG T671, LSG T671 LB T673, LV T673, LT T673, LW T673 LH T674 LS T676, LA T676, LO T676, LY T676, LB T676, LH T676, LSB T676, LW T676 LB T67C, LV T67C, LT T67C, LS T67K, LO T67K, LY T67K, LW E67C LS E67B, LA E67B, LO E67B, LY E67B, LB E67C, LV E67C, LT E67C LW T67C LS T679, LY T679, LG T679 LS T770, LO T770, LY T770, LG T770, LP T770 LB T773, LV T773, LT T773, LW T773 LH T774 LS E675, LA E675, LY E675, LS T675 LS T776, LA T776, LO T776, LY T776, LB T776 LHGB T686 LT T68C, LB T68C - Hyper Mini TOPLED® LB M676 - Mini TOPLED Santana® LG M470 LS M47K, LO M47K, LY M47K Source: http://www.osram.convergy.de LUXEON: - LUMILED® LXK2-PW12-R00, LXK2-PW12-S00, LXK2-PW14-U00, LXK2-PW14-V00 LXK2-PM12-R00, LXK2-PM12-S00, LXK2-PM14-U00 LXK2-PE12-Q00, LXK2-PE12-R00, LXK2-PE12-S00, LXK2-PE14-T00, LXK2-PE14-U00 LXK2-PB12-K00, LXK2-PB12-L00, LXK2-PB12-M00, LXK2-PB14-N00, LXK2-PB14-P00, LXK2-PB14-Q00 LXK2-PR12-L00, LXK2-PR12-M00, LXK2-PR14-Q00, LXK2-PR14-R00 LXK2-PD12-Q00, LXK2-PD12-R00, LXK2-PD12-S00 LXK2-PH12-R00, LXK2-PH12-S00 LXK2-PL12-P00, LXK2-PL12-Q00, LXK2-PL12-R00 Source: www.luxeon.com KINGBRIGHT: KA-3528ASYC Source: www.kingbright.com
MAGNETFELD = pinhead:PINHD-1X4: PIN HEADER
PIXY1 = pinhead:PINHD-2X3: PIN HEADER
PL3 = KLEMMEN:STLZ950G2
R1-R7 R19-R80 R84-R87 R92-R95 R124 R127 R128 R140-R145 = R:R1206
S1 S2 = schalter_taster:KSM611A
SW1 SW2 = schalter_taster:MSS13ASP
U$1 U$6 = motor_driver_module_library:MOTOR_DRIVER_MODULE
U$28 = Bluetoth:BLUETOTHA
U$32 = Teensy_3_and_LC_Series_Boards_v1.4:TEENSY_3.6_ALL_PINS: All PIN version of the Teensy 3.6.
U$58 = LOGICLeVELCONVERTER:LOGICLEVEL
X1 = Analog-Digital:ANALOG/DIGITAL-MUX-BREAKOUT